# Altium schematic sheet Power_dist.SchDoc
size A4; SheetNumber: 1; SheetTotal: 6
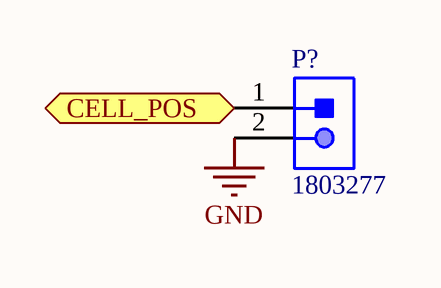
[diagram p0: Power_dist.SchDoc]

## Parts
P?  1803277  [PHOE-1803277_V]

## Ports
CELL_POS (bidir)

## Nets
GND: P?.2
CELL_POS: P?.1 ; port CELL_POS

## Library data of the parts
P? = CMP-002-00014-2: Male Header, Pitch 3.81 mm, 1 x 2 Position, Height 7.25 mm, Tail Length 3.4 mm, RoHS, Bulk; Manufacturer: Phoenix Contact; Voltage Rating: 160V; Current Rating: 8A; Rows: 1; Mounting Technology: TH; Contact Plating: Tin; Case/Package: 1803277; Gender: Male; Diameter: 7.25mm; Datasheet Version: Feb-14; Colour: Green; Pins: 2; Lead Pitch: 0.15inch; Connector Type: Header; Package Quantity: 50; Max Current Rating: 8A; Manufacturer URL: http://www.phoenixcontact.com/; Packaging: Bulk; RoHS Compliant: True; Datasheet URL: https://datasheet.ciiva.com/16096/1803277-16096845.pdf; Package Reference: 1803277; Package Description: Male Header, Pitch 3.81 mm, 1 x 2 Position, Height 7.25 mm, Tail Length 3.4 mm